# Altium project NeuroPico Hub.PrjPcb (part 2 of 2)

## Sheet DC SEPIC.SchDoc
size 297 x 209 mm; CompanyName: Sainsbury Wellcome Centre; Organization: FabLab; Address1: Sainsbury Wellcome Centre; Address2: 25 Howland Street; Address3: London; Address4: W1T 4JG; DocumentNumber: 8; SheetNumber: 8; SheetTotal: 14; swcgroup: FabLab; Org: Sainsbury Wellcome Centre; Add1: 25 Howland Street; Add2: London; Add3: W1T 4JG; WebAddress: www.sainsburywellcome.org; SheetSize: A4; SheetName: DC SEPIC
Used 4 times, as channels USB PD Controller0/DC SEPIC, USB PD Controller1/DC SEPIC, USB PD Controller2/DC SEPIC, USB PD Controller3/DC SEPIC. Parts and nets are listed once, with the designators drawn on the sheet.
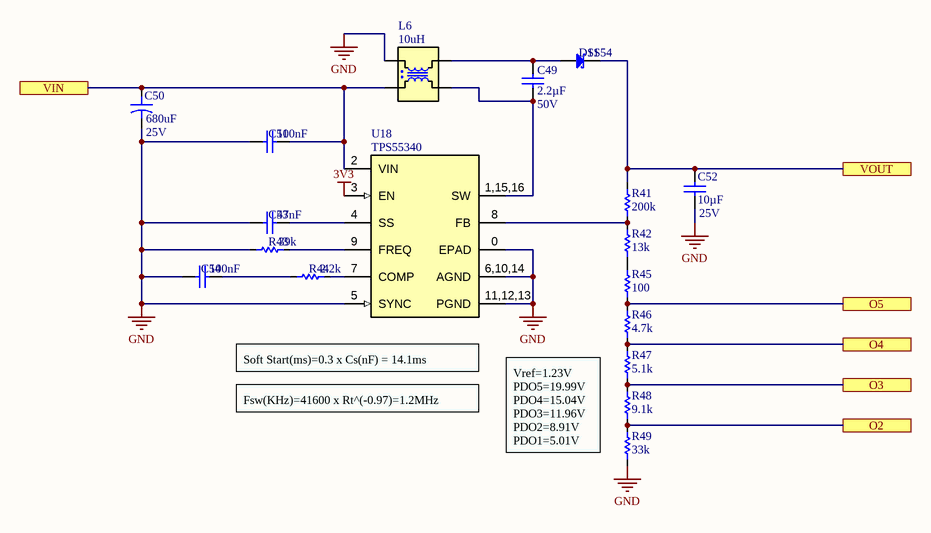
[diagram p10: DC SEPIC.SchDoc]

### Parts
C49  value 2.2µF  Voltage Rating: 50V  [CAP_CHIP_1210]  (hidden comment: C1210-2.2uF-50V)
C50  value 680uF  Voltage Rating: 25V  [ECAP_SMD_D8_10.2L]  (hidden comment: SC8-680uF-25V)
C51  value 100nF  [CAP_CHIP_0603]  (hidden comment: C0603-100nF-50V)
C52  value 10µF  Voltage Rating: 25V  [CAP_CHIP_0603]  (hidden comment: C0603-10uF-25V)
C53  value 47nF  [CAP_CHIP_0603]  (hidden comment: C0603-47nF-50V)
C54  value 100nF  [CAP_CHIP_0603]  (hidden comment: C0603-100nF-50V)
D11  SS54  [DO214AC/SMA]
L6  10uH  [IND_PWR_4P_1212]
R41  value 200k  [RES_CHIP_0603]  (hidden comment: R0603-200K)
R42  value 13k  [RES_CHIP_0603]  (hidden comment: R0603-13K)
R43  value 39k  [RES_CHIP_0603]  (hidden comment: R0603-39K)
R44  value 2.2k  [RES_CHIP_0603]  (hidden comment: R0603-2K2)
R45  value 100  [RES_CHIP_0603]  (hidden comment: R0603-100R)
R46  value 4.7k  [RES_CHIP_0603]  (hidden comment: R0603-4K7)
R47  value 5.1k  [RES_CHIP_0603]  (hidden comment: R0603-5K1)
R48  value 9.1k  [RES_CHIP_0603]  (hidden comment: R0603-9K1)
R49  value 33k  [RES_CHIP_0603]  (hidden comment: R0603-33K)
U18  TPS55340  [WQFN16_3X3_0.5E]

### Ports
O2, O3, O4, O5, VIN, VOUT

### Nets
3V3: U18.3(EN)
GND: C50.2 C51.2 C52.1 C53.1 C54.2 L6.2 R43.1 R49.1 U18.0(EPAD) U18.5(SYNC) U18.6,10,14(AGND) U18.11,12,13(PGND)
O2: R48.1 R49.2 ; port O2
O3: R47.1 R48.2 ; port O3
O4: R46.1 R47.2 ; port O4
O5: R45.1 R46.2 ; port O5
VIN: C50.1 C51.1 L6.1 U18.2(VIN) ; port VIN
VOUT: C52.2 D11.1(C) R41.2 ; port VOUT
NetC49_1: C49.1 D11.2(A) L6.4
NetC49_2: C49.2 L6.3 U18.1,15,16(SW)
NetC53_2: C53.2 U18.4(SS)
NetC54_1: C54.1 R44.2
NetR41_1: R41.1 R42.2 U18.8(FB)
NetR42_1: R42.1 R45.2
NetR43_2: R43.2 U18.9(FREQ)
NetR44_1: R44.1 U18.7(COMP)

### Channels
USB PD Controller0/DC SEPIC: designators end in A; ports O2=NetQ12A_3 O3=NetQ10A_3 O4=NetQ8A_3 O5=NetQ6A_3 VIN=VIN VOUT=NetC52A_2
USB PD Controller1/DC SEPIC: designators end in B; ports O2=NetQ12B_3 O3=NetQ10B_3 O4=NetQ8B_3 O5=NetQ6B_3 VIN=VIN VOUT=NetC52B_2
USB PD Controller2/DC SEPIC: designators end in C; ports O2=NetQ12C_3 O3=NetQ10C_3 O4=NetQ8C_3 O5=NetQ6C_3 VIN=VIN VOUT=NetC52C_2
USB PD Controller3/DC SEPIC: designators end in D; ports O2=NetQ12D_3 O3=NetQ10D_3 O4=NetQ8D_3 O5=NetQ6D_3 VIN=VIN VOUT=NetC52D_2

### Notes on the sheet
- Fsw(KHz)=41600 x Rt^(-0.97)=1.2MHz
- (near U18) Soft Start(ms)=0.3 x Cs(nF) = 14.1ms
- Vref=1.23V
  PDO5=19.99V
  PDO4=15.04V
  PDO3=11.96V
  PDO2=8.91V
  PDO1=5.01V
- FILE
- VARIANT
- DATE
- REVISION
- SHEET
- /
- PROJECT
- SIZE

### Library data of the parts
C49 = CMP-611-0036-5: 1210 Multilayer Ceramic Capacitors MLCC; PartNumber: 1210B225K500NT; Dielectric: X7R; Pick&PlaceFootprint: C1210; Tolerance: 10%; LCSC Part N.: C1950; Case/Package: 1210; Mount: Surface Mount; Capacitor Type: Ceramic; RoHS: Yes
C50 = CMP-610-0010-1: 25V 680uF ±20% SMD,D8xL10.5mm Solid Capacitors; PartNumber: HV1E687M0810PZ; Pick&PlaceFootprint: EC8; ESR (Equivalent Series Resistance): 25mR; Capacitor Type: Solid; LCSC Part N.: C5246549; Tolerance: 20%; RoHS: Yes; Mount: Surface Mount
C51 C54 = CMP-611-0027-24: as C2 on sheet Clock Input; Capacitor Type: Ceramic; RoHS: Yes; Mount: SMD; LCSC Part N.: C14663; Case/Package: 0603
C52 = CMP-611-0050-6: 0603 Multilayer Ceramic Capacitors MLCC; PartNumber: CL10A106MA8NRNC; Dielectric: X5R; Pick&PlaceFootprint: C0603; Tolerance: 20%; Case/Package: 0603; LCSC Part N.: C96446; RoHS: Yes; Capacitor Type: Ceramic; Mount: SMD
C53 = CMP-611-0073-1: 0603 Multilayer Ceramic Capacitors MLCC; PartNumber: CL10B473KB8NNNC; Tolerance: 10%; Pick&PlaceFootprint: C0603; Voltage Rating: 50V; Dielectric: X7R; Mount: SMD; LCSC Part N.: C1622; Case/Package: 0603; RoHS: Yes; Capacitor Type: Ceramic
D11 = CMP-821-0012-2: 40V 550mV@5A 5A SMA(DO-214AC) Schottky Barrier Diodes (SBD); Forward Voltage: 550mV; Rectified Current: 5A; PartNumber: SS54; Pick&PlaceFootprint: SMA; LCSC Part N.: C22452; Mount: Surface Mount; Max Reverse Voltage: 40V
L6 = CMP-620-0011-4: Ind Power Shielded Wirewound 10uH/40uH 20% 100KHz Ferrite 5.35A/2.67A T/R; PartNumber: SRF1260-100M; RMS Current (Irms): 5.35A; DC Resistance (DCR): 24mR; Saturation Current: 7.17A; Tolerance: 20%; LCSC Part N.: C7084460; Value: 10uH
R41 = CMP-633-0101-12: 100mW Thick Film Resistors 75V ±100ppm/℃ ±1% 0603 Chip Resistor; PartNumber: 0603WAF2003T5E; Pick&PlaceFootprint: R0603; Number of Resistors: 1; Case/Package: 0603; Voltage Rating: 75V; LCSC Part N.: C25811; Mount: Surface Mount; Tolerance: 1%; Power Rating: 100mW
R42 = CMP-633-0102-11: 100mW Thick Film Resistors 75V ±100ppm/℃ ±1% 0603 Chip Resistor; PartNumber: 0603WAF1302T5E; Pick&PlaceFootprint: R0603; Number of Resistors: 1; Mount: Surface Mount; Voltage Rating: 75V; Case/Package: 0603; Power Rating: 100mW; Tolerance: 1%; LCSC Part N.: C22797
R43 = CMP-633-0119-5: 100mW Thick Film Resistors 75V ±100ppm/℃ ±1% 0603 Chip Resistor; PartNumber: 0603WAF3902T5E; Pick&PlaceFootprint: R0603; Number of Resistors: 1; Tolerance: 1%; LCSC Part N.: C23153; Case/Package: 0603; Voltage Rating: 75V; Power Rating: 100mW; Mount: Surface Mount
R44 = CMP-633-0070-21: 100mW Thick Film Resistors 75V ±100ppm/℃ ±1% 0603 Chip Resistor; PartNumber: 0603WAF2201T5E; Pick&PlaceFootprint: R0603; Number of Resistors: 1; Power Rating: 100mW; Mount: Surface Mount; Voltage Rating: 75V; Tolerance: 1%; LCSC Part N.: C4190; Case/Package: 0603
R45 = CMP-633-0094-12: 100mW Thick Film Resistors 75V ±100ppm/℃ ±1% 0603 Chip Resistor; PartNumber: 0603WAF1000T5E; Number of Resistors: 1; Pick&PlaceFootprint: R0603; Case/Package: 0603; Voltage Rating: 75V; Mount: Surface Mount; Tolerance: 1%; LCSC Part N.: C22775; Power Rating: 100mW
R46 = CMP-633-0024-26: 100mW Thick Film Resistors 75V ±100ppm/℃ ±1% 0603 Chip Resistor; PartNumber: 0603WAF4701T5E; Pick&PlaceFootprint: R0603; Number of Resistors: 1; Case/Package: 0603; Voltage Rating: 75V; Tolerance: 1%; Power Rating: 100mW; LCSC Part N.: C23162; Mount: Surface Mount
R47 = CMP-633-0090-12: 100mW Thick Film Resistors 75V ±100ppm/℃ ±1% 0603 Chip Resistor; PartNumber: 0603WAF5101T5E; Number of Resistors: 1; Pick&PlaceFootprint: R0603; Voltage Rating: 75V; Case/Package: 0603; Power Rating: 100mW; Tolerance: 1%; LCSC Part N.: C23186; Mount: Surface Mount
R48 = CMP-633-0113-5: 100mW Thick Film Resistors 75V ±100ppm/℃ ±1% 0603 Chip Resistor; PartNumber: 0603WAF9101T5E; Pick&PlaceFootprint: R0603; Number of Resistors: 1; Power Rating: 100mW; Mount: Surface Mount; Tolerance: 1%; Voltage Rating: 75V; Case/Package: 0603; LCSC Part N.: C23260
R49 = CMP-633-0105-10: 100mW Thick Film Resistors 75V ±100ppm/℃ ±1% 0603 Chip Resistor; PartNumber: 0603WAF3302T5E; Pick&PlaceFootprint: R0603; Number of Resistors: 1; Tolerance: 1%; Mount: Surface Mount; Voltage Rating: 75V; LCSC Part N.: C4216; Case/Package: 0603; Power Rating: 100mW
U18 = CMP-970-0061-2: 5-A, 40-V, wide VIN boost, flyback, & SEPIC converter 16-WQFN -40 to 150; PartNumber: TPS55340RTER; Max Output Voltage: 38V; Max Output current: 5A; Switching Frequency: 1.14MHz; Reference Voltage: 1.229V; Max Input Voltage: 32V; RDS(On): 120mR; Min Input Voltage: 2.9V; LCSC Part N.: C169167; Switcher Configuration: Boost

## Sheet PD Controller Source.SchDoc
size 297 x 209 mm; CompanyName: Sainsbury Wellcome Centre; Organization: FabLab; Address1: Sainsbury Wellcome Centre; Address2: 25 Howland Street; Address3: London; Address4: W1T 4JG; DocumentNumber: 9; SheetNumber: 9; SheetTotal: 14; swcgroup: FabLab; Org: Sainsbury Wellcome Centre; Add1: 25 Howland Street; Add2: London; Add3: W1T 4JG; WebAddress: www.sainsburywellcome.org; SheetSize: A4; SheetName: PD Controller Source
Used 4 times, as channels USB PD Controller0/PD Controller Source, USB PD Controller1/PD Controller Source, USB PD Controller2/PD Controller Source, USB PD Controller3/PD Controller Source. Parts and nets are listed once, with the designators drawn on the sheet.
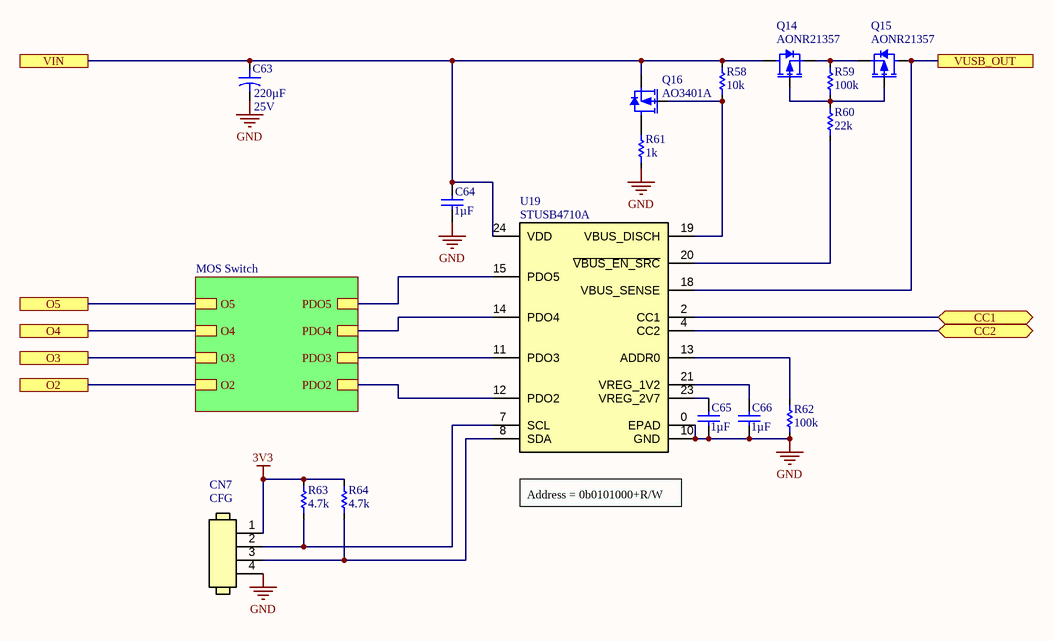
[diagram p11: PD Controller Source.SchDoc]

### Parts
C63  value 220µF  Voltage Rating: 25V  [ECAP_SMD_6.3]  (hidden comment: SC63-220uF-25V)
C64  value 1µF  [CAP_CHIP_0603]  (hidden comment: C0603-1uF-50V)
C65  value 1µF  [CAP_CHIP_0603]  (hidden comment: C0603-1uF-50V)
C66  value 1µF  [CAP_CHIP_0603]  (hidden comment: C0603-1uF-50V)
CN7  CFG  [MOLEX_1.25_4P]
Q14  AONR21357  [DFN-8-MOS]
Q15  AONR21357  [DFN-8-MOS]
Q16  AO3401A  [SOT23]
R58  value 10k  [RES_CHIP_0603]  (hidden comment: R0603-10K)
R59  value 100k  [RES_CHIP_0603]  (hidden comment: R0603-100K)
R60  value 22k  [RES_CHIP_0603]  (hidden comment: R0603-22K)
R61  value 1k  [RES_CHIP_0805]  (hidden comment: R0805-1K)
R62  value 100k  [RES_CHIP_0603]  (hidden comment: R0603-100K)
R63  value 4.7k  [RES_CHIP_0603]  (hidden comment: R0603-4K7)
R64  value 4.7k  [RES_CHIP_0603]  (hidden comment: R0603-4K7)
U19  STUSB4710A  [QFN24]

### Sub-sheets
MOS Switch = MOS Switch.SchDoc: O5, O4, O3, O2, PDO2, PDO3, PDO4, PDO5

### Ports
CC1 (bidir), CC2 (bidir), O2, O3, O4, O5, VIN, VUSB_OUT

### Nets
3V3: CN7.1 R63.2 R64.2
GND: C63.2 C64.2 C65.2 C66.2 CN7.4 R61.1 R62.1 U19.0(EPAD) U19.10(GND)
CC1: U19.2(CC1) ; port CC1
CC2: U19.4(CC2) ; port CC2
O2: port O2, sheet MOS Switch/O2
O3: port O3, sheet MOS Switch/O3
O4: port O4, sheet MOS Switch/O4
O5: port O5, sheet MOS Switch/O5
VIN: C63.1 C64.1 Q14.5(D) Q16.2(S) R58.2 U19.24(VDD) ; port VIN
VUSB_OUT: Q15.5(D) U19.18(VBUS_SENSE) ; port VUSB_OUT
NetC65_1: C65.1 U19.23(VREG_2V7)
NetC66_1: C66.1 U19.21(VREG_1V2)
NetCN7_2: CN7.2 R63.1 U19.7(SCL)
NetCN7_3: CN7.3 R64.1 U19.8(SDA)
NetQ14_1,2,3: Q14.1,2,3(S) Q15.1,2,3(S) R59.2
NetQ14_4: Q14.4(G) Q15.4(G) R59.1 R60.2
NetQ16_1: Q16.1(G) R58.1 U19.19(VBUS_DISCH)
NetQ16_3: Q16.3(D) R61.2
NetR60_1: R60.1 U19.20(~{VBUS_EN_SRC})
NetR62_2: R62.2 U19.13(ADDR0)
NetU19_11: U19.11(PDO3) ; sheet MOS Switch/PDO3
NetU19_12: U19.12(PDO2) ; sheet MOS Switch/PDO2
NetU19_14: U19.14(PDO4) ; sheet MOS Switch/PDO4
NetU19_15: U19.15(PDO5) ; sheet MOS Switch/PDO5

### Channels
USB PD Controller0/PD Controller Source: designators end in A; ports CC1=CC10 CC2=CC20 O2=NetQ12A_3 O3=NetQ10A_3 O4=NetQ8A_3 O5=NetQ6A_3 VIN=NetC52A_2 VUSB_OUT=VUSB_OUT0
USB PD Controller1/PD Controller Source: designators end in B; ports CC1=CC11 CC2=CC21 O2=NetQ12B_3 O3=NetQ10B_3 O4=NetQ8B_3 O5=NetQ6B_3 VIN=NetC52B_2 VUSB_OUT=VUSB_OUT1
USB PD Controller2/PD Controller Source: designators end in C; ports CC1=CC12 CC2=CC22 O2=NetQ12C_3 O3=NetQ10C_3 O4=NetQ8C_3 O5=NetQ6C_3 VIN=NetC52C_2 VUSB_OUT=VUSB_OUT2
USB PD Controller3/PD Controller Source: designators end in D; ports CC1=CC13 CC2=CC23 O2=NetQ12D_3 O3=NetQ10D_3 O4=NetQ8D_3 O5=NetQ6D_3 VIN=NetC52D_2 VUSB_OUT=VUSB_OUT3

### Notes on the sheet
- Address = 0b0101000+R/W
- FILE
- VARIANT
- DATE
- REVISION
- SHEET
- /
- PROJECT
- SIZE

### Library data of the parts
C63 = CMP-610-0003-4: 25V 220uF ±20% SMD,D6.3xL7.7mm Solid Capacitors; PartNumber: HV1E477M0810PZ; Pick&PlaceFootprint: EC63; ESR (Equivalent Series Resistance): 35mR; Mount: Surface Mount; RoHS: Yes; Capacitor Type: Solid; LCSC Part N.: C5246541; Tolerance: 20%
C64-C66 = CMP-611-0033-11: as C18 on sheet System Power; Case/Package: 0603; LCSC Part N.: C15849; RoHS: Yes; Mount: SMD; Capacitor Type: Ceramic
CN7 = CMP-370-0030-7: Conn Shrouded Header (3 Sides) HDR 4 POS 1.25mm Solder ST Top Entry SMD PicoBlade™ T/R; PartNumber: 53398-0471; Current Rating: 1A; Number of Positions: 4; Gender: Male; LCSC Part N.: C17617036; Orientation: Vertical; Number of Rows: 1; Pitch: 1.25mm; Mounting Technology: Surface Mount
Q14 Q15 = CMP-810-0004-1: 30V 30A 7.8mΩ@10V,20A 2.3V@250uA 1 PChannel DFN-8 MOSFETs; Drain-Source Voltage (Vds): -30V; RDS(ON): 8mR; Gate-Source Voltage (Vgs): 25V; Power Dissipation: 30W; Switching Time: 200ns; Drain Current (Id): -34A; Polarity: P Channel; Mount: Surface Mount; Pick&PlaceFootprint: DFN-8; PartNumber: AONR21357; LCSC Part N.: C431196
Q16 = CMP-810-0003-2: 30V 4A 44mΩ@10V,4.3A 1.4W 1.3V@250uA 1 PChannel SOT-23-3L MOSFETs; RDS(ON): 44mR; Gate-Source Voltage (Vgs): 12V; Pick&PlaceFootprint: SOT-23; Drain Current (Id): -4A; Switching Time: 60ns; Drain-Source Voltage (Vds): -30V; Polarity: P Channel; Power Dissipation: 1.4W; LCSC Part N.: C15127; Mount: Surface Mount; PartNumber: AO3401A
R58 = CMP-633-0002-26: 100mW Thick Film Resistors 75V ±100ppm/℃ ±1% 0603 Chip Resistor; PartNumber: 0603WAF1002T5E; Number of Resistors: 1; Pick&PlaceFootprint: R0603; Case/Package: 0603; Voltage Rating: 75V; Power Rating: 100mW; LCSC Part N.: C25804; Tolerance: 1%; Mount: Surface Mount
R59 R62 = CMP-633-0000-28: as R12 on sheet System Power; LCSC Part N.: C25803; Mount: Surface Mount; Voltage Rating: 75V; Power Rating: 100mW; Case/Package: 0603; Tolerance: 1%
R60 = CMP-633-0099-12: 100mW Thick Film Resistors 75V ±100ppm/℃ ±1% 0603 Chip Resistor; PartNumber: 0603WAF2202T5E; Pick&PlaceFootprint: R0603; Number of Resistors: 1; LCSC Part N.: C31850; Mount: Surface Mount; Case/Package: 0603; Voltage Rating: 75V; Power Rating: 100mW; Tolerance: 1%
R61 = CMP-633-0028-14: 125mW Thick Film Resistors 150V ±100ppm/℃ ±1% 0805 Chip Resistor; PartNumber: 0805W8F1001T5E; Pick&PlaceFootprint: R0805; Number of Resistors: 1; Voltage Rating: 150V; Mount: SMD; Case/Package: 0805; Power Rating: 125mW; Tolerance: 1%; LCSC Part N.: C17513
R63 R64 = CMP-633-0024-26: as R46 on sheet DC SEPIC; Case/Package: 0603; Voltage Rating: 75V; Tolerance: 1%; Power Rating: 100mW; LCSC Part N.: C23162; Mount: Surface Mount
U19 = CMP-970-0030-12: Power Supply Support Circuit, Adjustable, 1 Channel, +0.2,.4..8,1.6,2.6; PartNumber: STUSB4710AQTR; Pick&PlaceFootprint: QFN24; LCSC Part N.: C2655458

## Sheet MOS Switch.SchDoc
size 297 x 209 mm; CompanyName: Sainsbury Wellcome Centre; Organization: FabLab; Address1: Sainsbury Wellcome Centre; Address2: 25 Howland Street; Address3: London; Address4: W1T 4JG; DocumentNumber: 10; SheetNumber: 10; SheetTotal: 14; swcgroup: FabLab; Org: Sainsbury Wellcome Centre; Add1: 25 Howland Street; Add2: London; Add3: W1T 4JG; WebAddress: www.sainsburywellcome.org; SheetSize: A4; SheetName: MOS Switch
Used 4 times, as channels USB PD Controller0/PD Controller Source/MOS Switch, USB PD Controller1/PD Controller Source/MOS Switch, USB PD Controller2/PD Controller Source/MOS Switch, USB PD Controller3/PD Controller Source/MOS Switch. Parts and nets are listed once, with the designators drawn on the sheet.
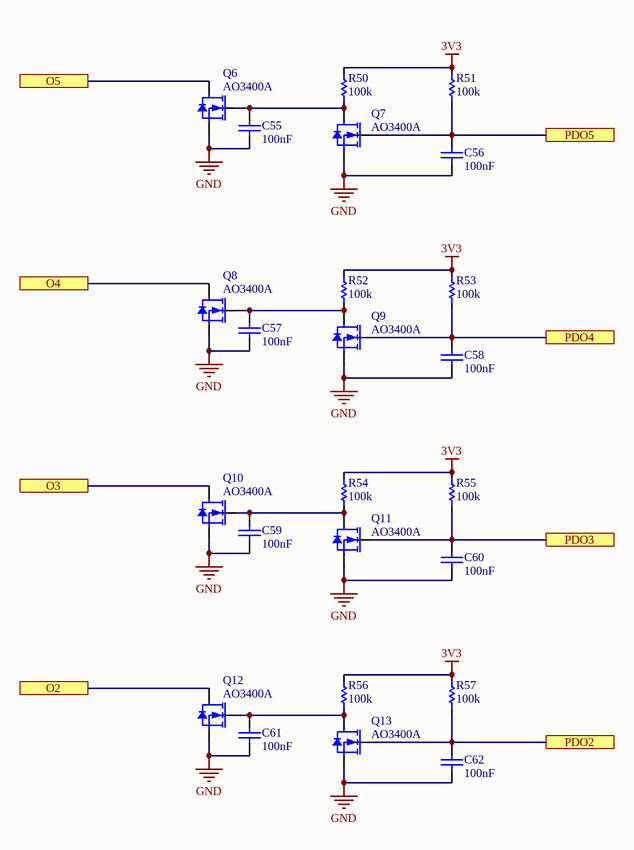
[diagram p12: MOS Switch.SchDoc]

### Parts
C55  value 100nF  [CAP_CHIP_0603]  (hidden comment: C0603-100nF-50V)
C56  value 100nF  [CAP_CHIP_0603]  (hidden comment: C0603-100nF-50V)
C57  value 100nF  [CAP_CHIP_0603]  (hidden comment: C0603-100nF-50V)
C58  value 100nF  [CAP_CHIP_0603]  (hidden comment: C0603-100nF-50V)
C59  value 100nF  [CAP_CHIP_0603]  (hidden comment: C0603-100nF-50V)
C60  value 100nF  [CAP_CHIP_0603]  (hidden comment: C0603-100nF-50V)
C61  value 100nF  [CAP_CHIP_0603]  (hidden comment: C0603-100nF-50V)
C62  value 100nF  [CAP_CHIP_0603]  (hidden comment: C0603-100nF-50V)
Q6  AO3400A  [SOT23]
Q7  AO3400A  [SOT23]
Q8  AO3400A  [SOT23]
Q9  AO3400A  [SOT23]
Q10  AO3400A  [SOT23]
Q11  AO3400A  [SOT23]
Q12  AO3400A  [SOT23]
Q13  AO3400A  [SOT23]
R50  value 100k  [RES_CHIP_0603]  (hidden comment: R0603-100K)
R51  value 100k  [RES_CHIP_0603]  (hidden comment: R0603-100K)
R52  value 100k  [RES_CHIP_0603]  (hidden comment: R0603-100K)
R53  value 100k  [RES_CHIP_0603]  (hidden comment: R0603-100K)
R54  value 100k  [RES_CHIP_0603]  (hidden comment: R0603-100K)
R55  value 100k  [RES_CHIP_0603]  (hidden comment: R0603-100K)
R56  value 100k  [RES_CHIP_0603]  (hidden comment: R0603-100K)
R57  value 100k  [RES_CHIP_0603]  (hidden comment: R0603-100K)

### Ports
O2, O3, O4, O5, PDO2, PDO3, PDO4, PDO5

### Nets
3V3: R50.2 R51.2 R52.2 R53.2 R54.2 R55.2 R56.2 R57.2
GND: C55.1 C56.1 C57.1 C58.1 C59.1 C60.1 C61.1 C62.1 Q6.2(S) Q7.2(S) Q8.2(S) Q9.2(S) Q10.2(S) Q11.2(S) Q12.2(S) Q13.2(S)
O2: Q12.3(D) ; port O2
O3: Q10.3(D) ; port O3
O4: Q8.3(D) ; port O4
O5: Q6.3(D) ; port O5
PDO2: C62.2 Q13.1(G) R57.1 ; port PDO2
PDO3: C60.2 Q11.1(G) R55.1 ; port PDO3
PDO4: C58.2 Q9.1(G) R53.1 ; port PDO4
PDO5: C56.2 Q7.1(G) R51.1 ; port PDO5
NetC55_2: C55.2 Q6.1(G) Q7.3(D) R50.1
NetC57_2: C57.2 Q8.1(G) Q9.3(D) R52.1
NetC59_2: C59.2 Q10.1(G) Q11.3(D) R54.1
NetC61_2: C61.2 Q12.1(G) Q13.3(D) R56.1

### Channels
USB PD Controller0/PD Controller Source/MOS Switch: designators end in A; ports O2=NetQ12A_3 O3=NetQ10A_3 O4=NetQ8A_3 O5=NetQ6A_3 PDO2=NetC62A_2 PDO3=NetC60A_2 PDO4=NetC58A_2 PDO5=NetC56A_2
USB PD Controller1/PD Controller Source/MOS Switch: designators end in B; ports O2=NetQ12B_3 O3=NetQ10B_3 O4=NetQ8B_3 O5=NetQ6B_3 PDO2=NetC62B_2 PDO3=NetC60B_2 PDO4=NetC58B_2 PDO5=NetC56B_2
USB PD Controller2/PD Controller Source/MOS Switch: designators end in C; ports O2=NetQ12C_3 O3=NetQ10C_3 O4=NetQ8C_3 O5=NetQ6C_3 PDO2=NetC62C_2 PDO3=NetC60C_2 PDO4=NetC58C_2 PDO5=NetC56C_2
USB PD Controller3/PD Controller Source/MOS Switch: designators end in D; ports O2=NetQ12D_3 O3=NetQ10D_3 O4=NetQ8D_3 O5=NetQ6D_3 PDO2=NetC62D_2 PDO3=NetC60D_2 PDO4=NetC58D_2 PDO5=NetC56D_2

### Notes on the sheet
- FILE
- VARIANT
- DATE
- REVISION
- SHEET
- /
- PROJECT
- SIZE

### Library data of the parts
C55-C62 = CMP-611-0027-24: 0603 Multilayer Ceramic Capacitors MLCC; PartNumber: CC0603KRX7R9BB104; Pick&PlaceFootprint: C0603; Dielectric: X7R; Voltage Rating: 50V; Tolerance: 10%; Case/Package: 0603; Capacitor Type: Ceramic; LCSC Part N.: C14663; Mount: SMD; RoHS: Yes
Q6-Q13 = CMP-810-0002-2: 30V 5.7A 26.5mΩ@10V,5.7A 1.4W 1.5V@250uA 1 NChannel SOT-23-3L MOSFETs; Gate-Source Voltage (Vgs): 12V; Pick&PlaceFootprint: SOT-23; RDS(ON): 26.5mR; Switching Time: 34.5ns; LCSC Part N.: C20917; Drain-Source Voltage (Vds): 30V; Mount: Surface Mount; PartNumber: AO3400A; Power Dissipation: 1.4W; Drain Current (Id): 5.7A; Polarity: N Channel
R50-R57 = CMP-633-0000-28: 100mW Thick Film Resistors 75V ±100ppm/℃ ±1% 0603 Chip Resistor; PartNumber: 0603WAF1003T5E; Number of Resistors: 1; Pick&PlaceFootprint: R0603; LCSC Part N.: C25803; Mount: Surface Mount; Voltage Rating: 75V; Power Rating: 100mW; Case/Package: 0603; Tolerance: 1%

## Sheet Clock Buffer.SchDoc
size 297 x 209 mm; CompanyName: Sainsbury Wellcome Centre; Organization: FabLab; Address1: Sainsbury Wellcome Centre; Address2: 25 Howland Street; Address3: London; Address4: W1T 4JG; DocumentNumber: 13; SheetNumber: 13; SheetTotal: 14; swcgroup: FabLab; Org: Sainsbury Wellcome Centre; Add1: 25 Howland Street; Add2: London; Add3: W1T 4JG; WebAddress: www.sainsburywellcome.org; SheetSize: A4; SheetName: Clock Buffer
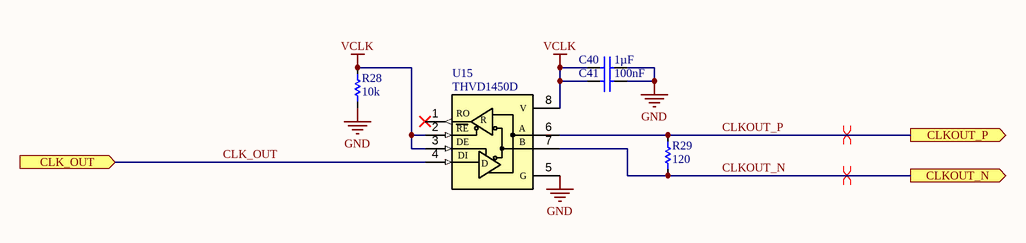
[diagram p13: Clock Buffer.SchDoc]

### Parts
C40  value 1µF  [CAP_CHIP_0603]  (hidden comment: C0603-1uF-50V)
C41  value 100nF  [CAP_CHIP_0603]  (hidden comment: C0603-100nF-50V)
R28  value 10k  [RES_CHIP_0603]  (hidden comment: R0603-10K)
R29  value 120  [RES_CHIP_0603]  (hidden comment: R0603-120R)
U15  THVD1450D  [VSSOP8_3X3_0.65E]

### Ports
CLK_OUT (in), CLKOUT_N (out), CLKOUT_P (out)

### Nets
GND: C40.1 C41.1 R28.1 U15.5(G)
VCLK: C40.2 C41.2 R28.2 U15.2(~{RE}) U15.3(DE) U15.8(V)
CLK_OUT: U15.4(D) ; port CLK_OUT
CLKOUT_N: R29.1 U15.7(B) ; port CLKOUT_N
CLKOUT_P: R29.2 U15.6(A) ; port CLKOUT_P

Not connected (* = marked no-connect by the designer): U15 1(RO)*

### Layout directives
differential pair; differential pair class RS485: CLKOUT_N, CLKOUT_P

### Notes on the sheet
- FILE
- VARIANT
- DATE
- REVISION
- SHEET
- /
- PROJECT
- SIZE
- (in symbol CMP-930-0015-1) R; RE; DI

### Library data of the parts
C40 = CMP-611-0033-11: 0603 Multilayer Ceramic Capacitors MLCC; PartNumber: CL10A105KB8NNNC; Pick&PlaceFootprint: C0603; Voltage Rating: 50V; Dielectric: X5R; Tolerance: 10%; Case/Package: 0603; LCSC Part N.: C15849; RoHS: Yes; Mount: SMD; Capacitor Type: Ceramic
C41 = CMP-611-0027-24: 0603 Multilayer Ceramic Capacitors MLCC; PartNumber: CC0603KRX7R9BB104; Tolerance: 10%; Pick&PlaceFootprint: C0603; Dielectric: X7R; Voltage Rating: 50V; Capacitor Type: Ceramic; RoHS: Yes; Mount: SMD; LCSC Part N.: C14663; Case/Package: 0603
R28 = CMP-633-0002-26: 100mW Thick Film Resistors 75V ±100ppm/℃ ±1% 0603 Chip Resistor; PartNumber: 0603WAF1002T5E; Number of Resistors: 1; Pick&PlaceFootprint: R0603; Case/Package: 0603; Voltage Rating: 75V; Power Rating: 100mW; LCSC Part N.: C25804; Tolerance: 1%; Mount: Surface Mount
R29 = CMP-633-0100-12: 100mW Thick Film Resistors 75V ±100ppm/℃ ±1% 0603 Chip Resistor; PartNumber: 0603WAF1200T5E; Pick&PlaceFootprint: R0603; Number of Resistors: 1; Mount: Surface Mount; Tolerance: 1%; Voltage Rating: 75V; Case/Package: 0603; Power Rating: 100mW; LCSC Part N.: C22787
U15 = CMP-930-0015-1: 3.3-V to 5-V RS-485 transceiver with ±18-kV IEC ESD protection 8-VSSOP -40 to 125; PartNumber: THVD1450DGKR; Simplex/Duplex: Half Duplex; Data Rate: 50Mbps; Max Supply Voltage: 5V; Min Supply Voltage: 3.3V; LCSC Part N.: C2860896

## Nets that join several sheets
3V3: System Power (C19.2 U4.5), Power Input (R24.2), USB Upstream (R15.1 R16.1), PD Controller Sink (5 pins), USB HUB (14 pins), USB PD Controller0/DC SEPIC (U18A.3), USB PD Controller0/PD Controller Source (CN7A.1 R63A.2 R64A.2), USB PD Controller0/PD Controller Source/MOS Switch (8 pins), USB PD Controller1/DC SEPIC (U18B.3), USB PD Controller1/PD Controller Source (CN7B.1 R63B.2 R64B.2), USB PD Controller1/PD Controller Source/MOS Switch (8 pins), USB PD Controller2/DC SEPIC (U18C.3), USB PD Controller2/PD Controller Source (CN7C.1 R63C.2 R64C.2), USB PD Controller2/PD Controller Source/MOS Switch (8 pins), USB PD Controller3/DC SEPIC (U18D.3), USB PD Controller3/PD Controller Source (CN7D.1 R63D.2 R64D.2), USB PD Controller3/PD Controller Source/MOS Switch (8 pins)
GND: USB Downstream0 (9 pins), USB Downstream1 (9 pins), USB Downstream2 (9 pins), USB Downstream3 (9 pins), System Power (13 pins), Clock Input (8 pins), Power Input (15 pins), Clock Thru (C39.2 U14.4), USB Upstream (15 pins), PD Controller Sink (11 pins), USB HUB (19 pins), USB PD Controller0/DC SEPIC (12 pins), USB PD Controller0/PD Controller Source (9 pins), USB PD Controller0/PD Controller Source/MOS Switch (16 pins), USB PD Controller1/DC SEPIC (12 pins), USB PD Controller1/PD Controller Source (9 pins), USB PD Controller1/PD Controller Source/MOS Switch (16 pins), USB PD Controller2/DC SEPIC (12 pins), USB PD Controller2/PD Controller Source (9 pins), USB PD Controller2/PD Controller Source/MOS Switch (16 pins), USB PD Controller3/DC SEPIC (12 pins), USB PD Controller3/PD Controller Source (9 pins), USB PD Controller3/PD Controller Source/MOS Switch (16 pins), Clock Buffer (C40.1 C41.1 R28.1 U15.5)
SHIELD: USB Downstream0 (C26A.1 C27A.1 CN2A.0 R14A.1), USB Downstream1 (C26B.1 C27B.1 CN2B.0 R14B.1), USB Downstream2 (C26C.1 C27C.1 CN2C.0 R14C.1), USB Downstream3 (C26D.1 C27D.1 CN2D.0 R14D.1)
VCLK: System Power (C23.2 U5.5), Clock Input (8 pins), Clock Thru (C39.1 U14.1), USB Upstream (C29.2 U10.8), Clock Buffer (6 pins)
CC10: USB Downstream0 (CN2A.A5 U8A.1), USB PD Controller0/PD Controller Source (U19A.2)
CC11: USB Downstream1 (CN2B.A5 U8B.1), USB PD Controller1/PD Controller Source (U19B.2)
CC12: USB Downstream2 (CN2C.A5 U8C.1), USB PD Controller2/PD Controller Source (U19C.2)
CC13: USB Downstream3 (CN2D.A5 U8D.1), USB PD Controller3/PD Controller Source (U19D.2)
CC20: USB Downstream0 (CN2A.B5 U8A.2), USB PD Controller0/PD Controller Source (U19A.4)
CC21: USB Downstream1 (CN2B.B5 U8B.2), USB PD Controller1/PD Controller Source (U19B.4)
CC22: USB Downstream2 (CN2C.B5 U8C.2), USB PD Controller2/PD Controller Source (U19C.4)
CC23: USB Downstream3 (CN2D.B5 U8D.2), USB PD Controller3/PD Controller Source (U19D.4)
CLK_OUT: Clock Input (R2.1), Clock Thru (U14.3), Clock Buffer (U15.4)
CLK_USB: Clock Input (U1.1), USB Upstream (R19.2)
CLKOUT_N: USB Downstream0 (L3A.4), USB Downstream1 (L3B.4), USB Downstream2 (L3C.4), USB Downstream3 (L3D.4), Clock Buffer (R29.1 U15.7)
CLKOUT_P: USB Downstream0 (L3A.1), USB Downstream1 (L3B.1), USB Downstream2 (L3C.1), USB Downstream3 (L3D.1), Clock Buffer (R29.2 U15.6)
NetC52A_2: USB PD Controller0/DC SEPIC (C52A.2 D11A.1 R41A.2), USB PD Controller0/PD Controller Source (6 pins)
NetC52B_2: USB PD Controller1/DC SEPIC (C52B.2 D11B.1 R41B.2), USB PD Controller1/PD Controller Source (6 pins)
NetC52C_2: USB PD Controller2/DC SEPIC (C52C.2 D11C.1 R41C.2), USB PD Controller2/PD Controller Source (6 pins)
NetC52D_2: USB PD Controller3/DC SEPIC (C52D.2 D11D.1 R41D.2), USB PD Controller3/PD Controller Source (6 pins)
NetC56A_2: USB PD Controller0/PD Controller Source (U19A.15), USB PD Controller0/PD Controller Source/MOS Switch (C56A.2 Q7A.1 R51A.1)
NetC56B_2: USB PD Controller1/PD Controller Source (U19B.15), USB PD Controller1/PD Controller Source/MOS Switch (C56B.2 Q7B.1 R51B.1)
NetC56C_2: USB PD Controller2/PD Controller Source (U19C.15), USB PD Controller2/PD Controller Source/MOS Switch (C56C.2 Q7C.1 R51C.1)
NetC56D_2: USB PD Controller3/PD Controller Source (U19D.15), USB PD Controller3/PD Controller Source/MOS Switch (C56D.2 Q7D.1 R51D.1)
NetC58A_2: USB PD Controller0/PD Controller Source (U19A.14), USB PD Controller0/PD Controller Source/MOS Switch (C58A.2 Q9A.1 R53A.1)
NetC58B_2: USB PD Controller1/PD Controller Source (U19B.14), USB PD Controller1/PD Controller Source/MOS Switch (C58B.2 Q9B.1 R53B.1)
NetC58C_2: USB PD Controller2/PD Controller Source (U19C.14), USB PD Controller2/PD Controller Source/MOS Switch (C58C.2 Q9C.1 R53C.1)
NetC58D_2: USB PD Controller3/PD Controller Source (U19D.14), USB PD Controller3/PD Controller Source/MOS Switch (C58D.2 Q9D.1 R53D.1)
NetC60A_2: USB PD Controller0/PD Controller Source (U19A.11), USB PD Controller0/PD Controller Source/MOS Switch (C60A.2 Q11A.1 R55A.1)
NetC60B_2: USB PD Controller1/PD Controller Source (U19B.11), USB PD Controller1/PD Controller Source/MOS Switch (C60B.2 Q11B.1 R55B.1)
NetC60C_2: USB PD Controller2/PD Controller Source (U19C.11), USB PD Controller2/PD Controller Source/MOS Switch (C60C.2 Q11C.1 R55C.1)
NetC60D_2: USB PD Controller3/PD Controller Source (U19D.11), USB PD Controller3/PD Controller Source/MOS Switch (C60D.2 Q11D.1 R55D.1)
NetC62A_2: USB PD Controller0/PD Controller Source (U19A.12), USB PD Controller0/PD Controller Source/MOS Switch (C62A.2 Q13A.1 R57A.1)
NetC62B_2: USB PD Controller1/PD Controller Source (U19B.12), USB PD Controller1/PD Controller Source/MOS Switch (C62B.2 Q13B.1 R57B.1)
NetC62C_2: USB PD Controller2/PD Controller Source (U19C.12), USB PD Controller2/PD Controller Source/MOS Switch (C62C.2 Q13C.1 R57C.1)
NetC62D_2: USB PD Controller3/PD Controller Source (U19D.12), USB PD Controller3/PD Controller Source/MOS Switch (C62D.2 Q13D.1 R57D.1)
NetCN3_A5: USB Upstream (CN3.A5 U12.1), PD Controller Sink (U17.1 U17.2)
NetCN3_B5: USB Upstream (CN3.B5 U12.2), PD Controller Sink (U17.4 U17.5)
NetQ1_3: Clock Input (Q1.3), USB Upstream (R21.2 U10.2)
NetQ3_3: USB Upstream (Q3.3 R16.2), USB HUB (U2.27)
NetQ6A_3: USB PD Controller0/DC SEPIC (R45A.1 R46A.2), USB PD Controller0/PD Controller Source/MOS Switch (Q6A.3)
NetQ6B_3: USB PD Controller1/DC SEPIC (R45B.1 R46B.2), USB PD Controller1/PD Controller Source/MOS Switch (Q6B.3)
NetQ6C_3: USB PD Controller2/DC SEPIC (R45C.1 R46C.2), USB PD Controller2/PD Controller Source/MOS Switch (Q6C.3)
NetQ6D_3: USB PD Controller3/DC SEPIC (R45D.1 R46D.2), USB PD Controller3/PD Controller Source/MOS Switch (Q6D.3)
NetQ8A_3: USB PD Controller0/DC SEPIC (R46A.1 R47A.2), USB PD Controller0/PD Controller Source/MOS Switch (Q8A.3)
NetQ8B_3: USB PD Controller1/DC SEPIC (R46B.1 R47B.2), USB PD Controller1/PD Controller Source/MOS Switch (Q8B.3)
NetQ8C_3: USB PD Controller2/DC SEPIC (R46C.1 R47C.2), USB PD Controller2/PD Controller Source/MOS Switch (Q8C.3)
NetQ8D_3: USB PD Controller3/DC SEPIC (R46D.1 R47D.2), USB PD Controller3/PD Controller Source/MOS Switch (Q8D.3)
NetQ10A_3: USB PD Controller0/DC SEPIC (R47A.1 R48A.2), USB PD Controller0/PD Controller Source/MOS Switch (Q10A.3)
NetQ10B_3: USB PD Controller1/DC SEPIC (R47B.1 R48B.2), USB PD Controller1/PD Controller Source/MOS Switch (Q10B.3)
NetQ10C_3: USB PD Controller2/DC SEPIC (R47C.1 R48C.2), USB PD Controller2/PD Controller Source/MOS Switch (Q10C.3)
NetQ10D_3: USB PD Controller3/DC SEPIC (R47D.1 R48D.2), USB PD Controller3/PD Controller Source/MOS Switch (Q10D.3)
NetQ12A_3: USB PD Controller0/DC SEPIC (R48A.1 R49A.2), USB PD Controller0/PD Controller Source/MOS Switch (Q12A.3)
NetQ12B_3: USB PD Controller1/DC SEPIC (R48B.1 R49B.2), USB PD Controller1/PD Controller Source/MOS Switch (Q12B.3)
NetQ12C_3: USB PD Controller2/DC SEPIC (R48C.1 R49C.2), USB PD Controller2/PD Controller Source/MOS Switch (Q12C.3)
NetQ12D_3: USB PD Controller3/DC SEPIC (R48D.1 R49D.2), USB PD Controller3/PD Controller Source/MOS Switch (Q12D.3)
USB_DS1_N: USB Downstream0 (L2A.4), USB HUB (U2.1)
USB_DS1_P: USB Downstream0 (L2A.1), USB HUB (U2.2)
USB_DS2_N: USB Downstream1 (L2B.4), USB HUB (U2.3)
USB_DS2_P: USB Downstream1 (L2B.1), USB HUB (U2.4)
USB_DS3_N: USB Downstream2 (L2C.4), USB HUB (U2.6)
USB_DS3_P: USB Downstream2 (L2C.1), USB HUB (U2.7)
USB_DS4_N: USB Downstream3 (L2D.4), USB HUB (U2.8)
USB_DS4_P: USB Downstream3 (L2D.1), USB HUB (U2.9)
USB_US.D_N: USB Upstream (L4.2), USB HUB (U2.30)
USB_US.D_P: USB Upstream (L4.3), USB HUB (U2.31)
VBUS: USB Upstream (C28.2 CN3.A4, A9, B4, B9 D6.2 R17.1), PD Controller Sink (6 pins)
VIN: System Power (C21.2 U3.5), Power Input (5 pins), PD Controller Sink (Q5.5 U16.8), USB PD Controller0/DC SEPIC (C50A.1 C51A.1 L6A.1 U18A.2), USB PD Controller1/DC SEPIC (C50B.1 C51B.1 L6B.1 U18B.2), USB PD Controller2/DC SEPIC (C50C.1 C51C.1 L6C.1 U18C.2), USB PD Controller3/DC SEPIC (C50D.1 C51D.1 L6D.1 U18D.2)
VUSB_OUT0: USB Downstream0 (C25A.2 CN2A.A4, A9, B4, B9 D5A.2), USB PD Controller0/PD Controller Source (Q15A.5 U19A.18)
VUSB_OUT1: USB Downstream1 (C25B.2 CN2B.A4, A9, B4, B9 D5B.2), USB PD Controller1/PD Controller Source (Q15B.5 U19B.18)
VUSB_OUT2: USB Downstream2 (C25C.2 CN2C.A4, A9, B4, B9 D5C.2), USB PD Controller2/PD Controller Source (Q15C.5 U19C.18)
VUSB_OUT3: USB Downstream3 (C25D.2 CN2D.A4, A9, B4, B9 D5D.2), USB PD Controller3/PD Controller Source (Q15D.5 U19D.18)